# EAGLE design Conveyor Limit Switch (EAGLE 9.6.2)
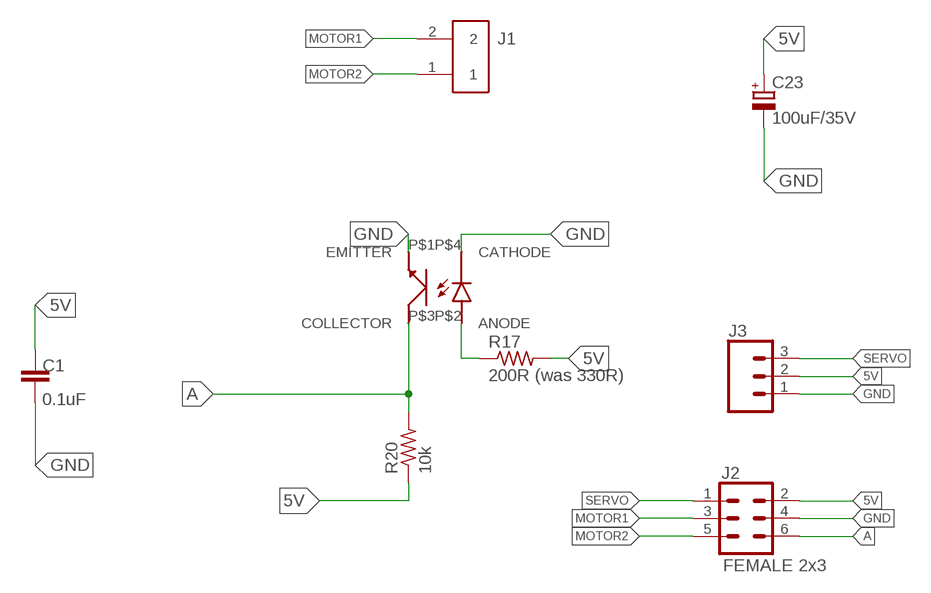
[diagram p0: schematic, sheet 1]

## Parts
C1  0.1uF  CAP_0603  [CAP_0603]
C23  100uF/35V  CPOL-EU153CLV-0605  [153CLV-0605]
J1  S2B-PH-SM4-TB(LF)(SN)  [S2B-PH-SM4-TB]
J2  FEMALE 2x3  CONN_03X2FEMALE  [2X3]
J3  CONN_03  [1X03]
R17  200R (was 330R)  RESISTOR_0603  [RESISTOR_0603]
R20  10k  RESISTOR_0603  [RESISTOR_0603]
U$2  IR_VCNT2020  [IR_VCNT2020]

## Nets
5V: C1.1 C23.+ J2.2 J3.2 R17.2 R20.1
A: J2.6 R20.2 U$2.P$3(COLLECTOR)
GND: C1.2 C23.- J2.4 J3.1 U$2.P$1(EMITTER) U$2.P$4(CATHODE)
LED2: R17.1 U$2.P$2(ANODE)
MOTOR1: J1.2 J2.3
MOTOR2: J1.1 J2.5
SERVO: J2.1 J3.3

## Library data of the parts
C1 = Shai-Parts:CAP_0603
C23 = rcl:CPOL-EU: POLARIZED CAPACITOR, European symbol; SPICEPREFIX: C
J1 = samacsys:S2B-PH-SM4-TB(LF)(SN): PH SMT side entry shroud header 2 way JST PH Series, 2mm Pitch 2 Way 1 Row Right Angle PCB Header, Solder Termination, 2A Source: Datasheet <https://www.jst.co.uk/downloads/series/TSSC017.01(PH).pdf>; DESCRIPTION: PH SMT side entry shroud header 2 way JST PH Series, 2mm Pitch 2 Way 1 Row Right Angle PCB Header, Solder Termination, 2A; HEIGHT: mm; MANUFACTURER_NAME: JST (JAPAN SOLDERLESS TERMINALS); MANUFACTURER_PART_NUMBER: S2B-PH-SM4-TB(LF)(SN); RS_PART_NUMBER: 6881353P; RS_PRICE-STOCK: http://uk.rs-online.com/web/p/products/6881353P
J2 = SparkFun-Connectors:CONN_03X2: Multi connection point. Often used as Generic Header-pin footprint for 0.1 inch spaced/style header connections You can populate with any combo of single row headers, but if you'd like an exact match, check these: Header - 2x3 (Male, 0.1") <https://www.sparkfun.com/products/12807> (PRT-12807) Header - 2x3 (Female, 0.1") <https://www.sparkfun.com/products/13010> (PRT-13010) 2x3 Pin Shrouded Header <https://www.sparkfun.com/products/10877> (PRT-10877) On any of the 0.1 inch spaced packages, you can populate with these: Break Away Headers - Straight <https://www.sparkfun.com/products/116> (PRT-00116) Break Away Male Headers - Right Angle <https://www.sparkfun.com/products/553> (PRT-00553) Female Headers <https://www.sparkfun.com/products/115> (PRT-00115) Break Away Headers - Machine Pin <https://www.sparkfun.com/products/117> (PRT-00117) Break Away Female Headers - Swiss Machine Pin <https://www.sparkfun.com/products/743> (PRT-00743) Special note: the shrouded connector mates well with our 3x2 ribbon cables: Ribbon Crimp Connector - 6-pin (2x3, Female) <https://www.sparkfun.com/products/10651> (PRT-10651) Ribbon Cable - 6 wire (15ft) <https://www.sparkfun.com/products/10646> (PRT-10646); PROD_ID: CONN-11566
J3 = SparkFun-Connectors:CONN_03: Multi connection point. Often used as Generic Header-pin footprint for 0.1 inch spaced/style header connections On any of the 0.1 inch spaced packages, you can populate with these: Break Away Headers - Straight <https://www.sparkfun.com/products/116> (PRT-00116) Break Away Male Headers - Right Angle <https://www.sparkfun.com/products/553> (PRT-00553) Female Headers <https://www.sparkfun.com/products/115> (PRT-00115) Break Away Headers - Machine Pin <https://www.sparkfun.com/products/117> (PRT-00117) Break Away Female Headers - Swiss Machine Pin <https://www.sparkfun.com/products/743> (PRT-00743) Stackable Header - 3 Pin (Female, 0.1") <https://www.sparkfun.com/products/13875> (PRT-13875) For SCREWTERMINALS and SPRING TERMINALS visit here: Screw Terimnals on SparkFun.com <https://www.sparkfun.com/search/results?term=Screw+Terminals> (5mm/3.5mm/2.54mm spacing) This device is also useful as a general connection point to wire up your design to another part of your project. Our various solder wires solder well into these plated through hole pads. Hook-Up Wire - Assortment (Stranded, 22 AWG) <https://www.sparkfun.com/products/11375> (PRT-11375) Hook-Up Wire - Assortment (Solid Core, 22 AWG) <https://www.sparkfun.com/products/11367> (PRT-11367) View the entire wire category on our website here <https://www.sparkfun.com/categories/141> Special notes: Molex polarized connector foot print use with SKU : PRT-08232 with associated crimp pins and housings.
R17 R20 = Shai-Parts:RESISTOR_0603
U$2 = Shai-Parts:IR_VCNT2020

## Board
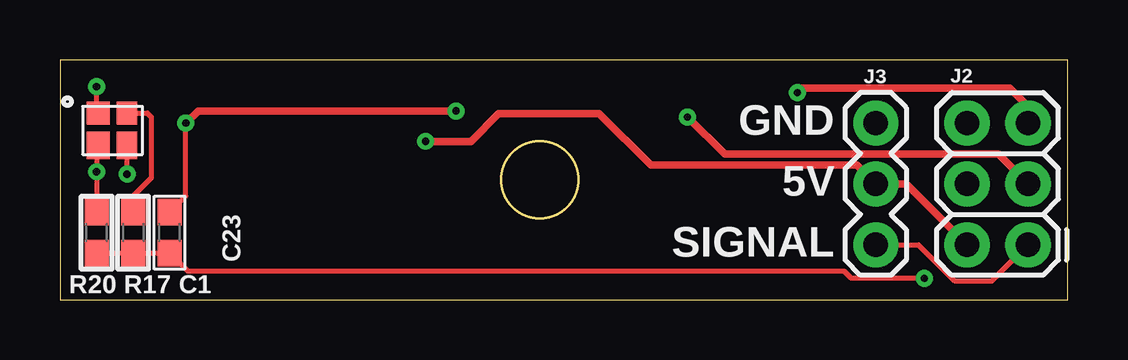
[diagram p1: board, top side]
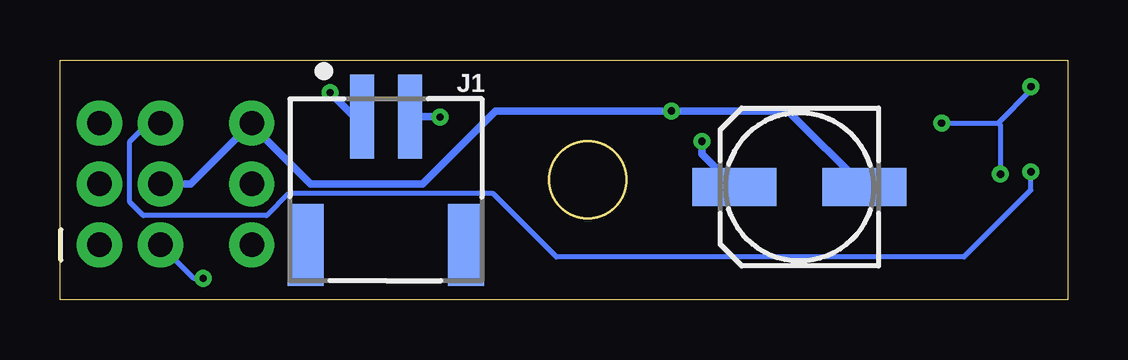
[diagram p2: board, bottom side, seen from below]

Size 42 x 10 mm. Coordinates in mm from the lower left corner, seen from the top.
Outline: 0,10 0,0 42,0 42,10 0,10
Outline: circle at 20,5 radius 1.6
Copper layers (1*16): Top 0.035mm / dielectric 1.5mm / Bottom 0.035mm
Design rules "default *": minimum track width 6mil, minimum drill 0.3mm, track to track 6mil, track to pad 6mil, pad to pad 6mil, via to via 6mil, smd to smd 6mil, copper to edge 20mil, drill to drill 6mil, minimum pad ring 10mil, minimum via ring 8mil, stop-mask expansion 4mil, vias tented up to drill 0.3mm, thermal gap 10mil

### Footprints (pad centres in the part's own frame; a part is rotated, then mirrored left to right if it is on the bottom)
CAP_0603 = smd 1.1 x 1: 1 -0.85,0; 2 0.85,0
153CLV-0605 = smd 3.5 x 1.6: + 2.7,0; - -2.7,0
S2B-PH-SM4-TB = smd 1 x 3.5: 1 5,0.75; 2 3,0.75 | smd 1.5 x 3.4: 3 0.65,6.1; 4 7.35,6.1
2X3 = drill 1.016 pad 1.88: 1 0,0; 2 0,2.54; 3 2.54,0; 4 2.54,2.54; 5 5.08,0; 6 5.08,2.54
1X03 = drill 1.016 pad 1.88: 1 0,0; 2 2.54,0; 3 5.08,0
RESISTOR_0603 = smd 1.1 x 1: 1 -0.85,0; 2 0.85,0
IR_VCNT2020 = smd 0.97 x 0.95: P$1 -0.6,0.675 | smd 0.85 x 0.95: P$2 0.6,0.675 | smd 0.97 x 1.15: P$3 -0.6,-0.675 | smd 0.85 x 1.15: P$4 0.6,-0.675

### Placement (x,y rotation side)
C1  4.57,2.79 90 top
C23  11.18,4.7 180 bottom
J1  24.42,8.38 180 bottom
J2  40.35,2.29 90 top
J3  34,7.37 270 top
R17  3.05,2.79 270 top
R20  1.52,2.79 90 top
U$2  2.19,7.11 0 top

### Tracks (layer width: path | path; a pad name or v marks a point on that pad's centre or on a via)
5V  (via drill 0.3)
  Top 0.203: R20.1 R17.2 C1.1 5.33,1.18 32.7,1.18 32.99,0.89 v36.04,0.89
  Top 0.305: J2.2 35.27,4.83 J3.2 33.22,5.61 24.63,5.61 22.47,7.77 18.29,7.77 17.12,6.6 v15.24,6.6
  Bottom 0.203: J2.2 36.42,0.89 v36.04,0.89
  Bottom 0.305: C23.+ 15.24,6.06 v15.24,6.6
A  (via drill 0.3)
  Top 0.203: U$2.P$3 1.52,6.37 v1.52,5.33 R20.2
  Bottom 0.203: v1.52,5.33 1.52,4.57 4.32,1.78 21.3,1.78 23.94,4.42 32.48,4.42 33.39,3.5 38.52,3.5 39.08,4.06 39.08,6.6 38.32,7.37 J2.6
GND  (via drill 0.3)
  Top 0.203: v5.25,7.37 5.25,4.32 C1.2 | U$2.P$4 v2.79,5.24 v2.79,5.23 | U$2.P$1 1.52,7.85 v1.52,8.88
  Top 0.305: v5.25,7.37 5.75,7.87 v16.51,7.87
  Bottom 0.203: v5.25,7.37 2.89,7.37 | v1.52,8.88 1.52,8.73 2.89,7.37 | 2.89,7.37 2.79,7.27 v2.79,5.23 | 34,7.28 J3.1
  Bottom 0.305: J2.4 36.54,4.83 J3.1 | 34,7.28 31.55,4.83 26.89,4.83 23.84,7.87 v16.51,7.87 11.65,7.87 C23.-
LED2
  Top 0.203: U$2.P$2 3.64,7.79 3.81,7.62 3.81,5.08 3.05,4.32 R17.1
MOTOR1  (via drill 0.3)
  Top 0.305: J2.3 39.11,6.07 27.71,6.07 v26.16,7.62
  Bottom 0.305: v26.16,7.62 26.17,7.63 J1.2
MOTOR2  (via drill 0.3)
  Top 0.305: J2.5 40.35,8.07 39.59,8.83 30.93,8.83 v30.73,8.64
  Bottom 0.305: v30.73,8.64 29.73,7.63 J1.1
SERVO
  Top 0.203: J3.3 35.78,2.29 37.31,0.76 38.83,0.76 J2.1

### Text on the board
tPlace: GND / 5V / SIGNAL